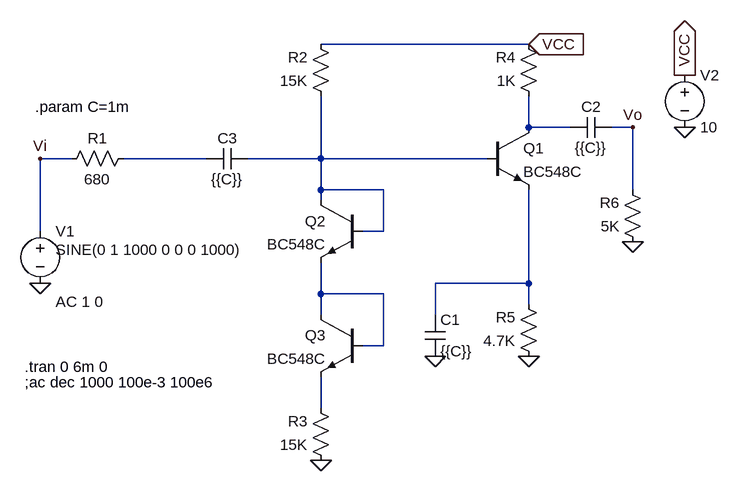
[diagram p0: schematic Tarea 1 - Electrónica Aplicada 1 - Alexander Daniel Rios.asc]
Tarea 1 - Electrónica Aplicada 1 - Alexander Daniel Rios.asc, the LTspice schematic file:
Version 4
SHEET 1 880 724
WIRE 64 0 -256 0
WIRE 64 128 64 80
WIRE 128 128 64 128
WIRE 224 128 192 128
WIRE -640 176 -688 176
WIRE -432 176 -560 176
WIRE -256 176 -256 80
WIRE -256 176 -368 176
WIRE 0 176 -256 176
WIRE -256 224 -256 176
WIRE -160 224 -256 224
WIRE 224 224 224 128
WIRE -256 240 -256 224
WIRE -688 288 -688 176
WIRE -160 288 -160 224
WIRE -160 288 -192 288
WIRE 64 368 64 224
WIRE 64 368 -80 368
WIRE -256 384 -256 336
WIRE -160 384 -256 384
WIRE 64 400 64 368
WIRE -256 416 -256 384
WIRE -80 416 -80 368
WIRE -160 464 -160 384
WIRE -160 464 -192 464
WIRE -256 560 -256 512
FLAG -256 640 0
FLAG 64 480 0
FLAG -80 480 0
FLAG -688 368 0
FLAG 304 128 0
FLAG 304 48 VCC
IOPIN 304 48 Out
FLAG 64 0 VCC
IOPIN 64 0 In
FLAG 224 304 0
FLAG -688 176 Vi
FLAG 224 128 Vo
SYMBOL npn 0 128 R0
SYMATTR InstName Q1
SYMATTR Value BC548C
SYMBOL npn -192 240 M0
SYMATTR InstName Q2
SYMATTR Value BC548C
SYMBOL npn -192 416 M0
SYMATTR InstName Q3
SYMATTR Value BC548C
SYMBOL res -544 160 R90
WINDOW 0 0 56 VBottom 2
WINDOW 3 32 56 VTop 2
SYMATTR InstName R1
SYMATTR Value 680
SYMBOL res -240 96 R180
WINDOW 0 36 76 Left 2
WINDOW 3 36 40 Left 2
SYMATTR InstName R2
SYMATTR Value 15K
SYMBOL res -240 656 R180
WINDOW 0 36 76 Left 2
WINDOW 3 36 40 Left 2
SYMATTR InstName R3
SYMATTR Value 15K
SYMBOL res 80 96 R180
WINDOW 0 36 76 Left 2
WINDOW 3 36 40 Left 2
SYMATTR InstName R4
SYMATTR Value 1K
SYMBOL res 80 496 R180
WINDOW 0 36 76 Left 2
WINDOW 3 36 40 Left 2
SYMATTR InstName R5
SYMATTR Value 4.7K
SYMBOL res 240 320 R180
WINDOW 0 36 76 Left 2
WINDOW 3 36 40 Left 2
SYMATTR InstName R6
SYMATTR Value 5K
SYMBOL cap -96 416 R0
SYMATTR InstName C1
SYMATTR Value {{C}}
SYMBOL cap 192 112 R90
WINDOW 0 0 32 VBottom 2
WINDOW 3 32 32 VTop 2
SYMATTR InstName C2
SYMATTR Value {{C}}
SYMBOL cap -368 160 R90
WINDOW 0 0 32 VBottom 2
WINDOW 3 32 32 VTop 2
SYMATTR InstName C3
SYMATTR Value {{C}}
SYMBOL voltage -688 272 R0
WINDOW 123 24 124 Left 2
WINDOW 39 0 0 Left 0
WINDOW 3 24 44 Left 2
SYMATTR Value2 AC 1 0
SYMATTR Value SINE(0 1 1000 0 0 0 1000)
SYMATTR InstName V1
SYMBOL voltage 304 32 R0
WINDOW 123 0 0 Left 0
WINDOW 39 0 0 Left 0
SYMATTR InstName V2
SYMATTR Value 10
TEXT -712 496 Left 2 !.tran 0 6m 0
TEXT -712 520 Left 2 !;ac dec 1000 100e-3 100e6
TEXT -696 96 Left 2 !.param C=1m

The netlist it stands for:
* Tarea 1 - Electrónica Aplicada 1 - Alexander Daniel Rios.asc
Q1 N001 N003 N004 0 BC548C
Q2 N003 N003 N005 0 BC548C
Q3 N005 N005 N006 0 BC548C
R1 N002 Vi 680
R2 N003 VCC 15K
R3 0 N006 15K
R4 N001 VCC 1K
R5 0 N004 4.7K
R6 0 Vo 5K
C1 N004 0 {{C}}
C2 Vo N001 {{C}}
C3 N003 N002 {{C}}
V1 Vi 0 SINE(0 1 1000 0 0 0 1000) AC 1 0
V2 VCC 0 10
.model NPN NPN
.model PNP PNP
.lib standard.bjt
.tran 0 6m 0
;ac dec 1000 100e-3 100e6
.param C=1m
.backanno
.end